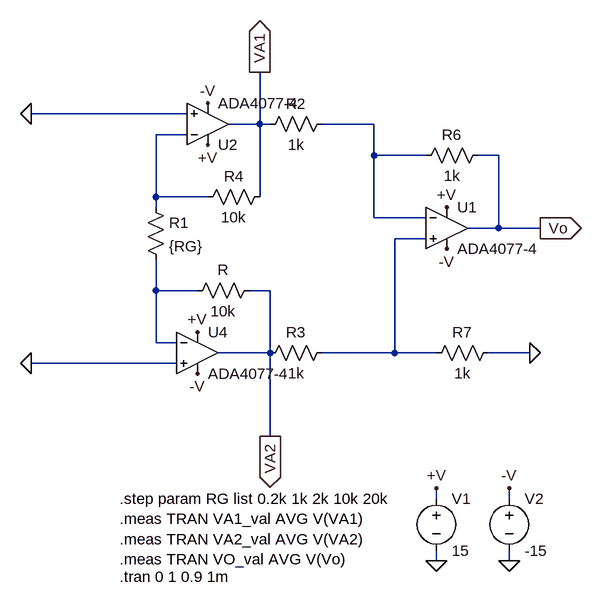
[diagram p0: schematic InstrumentationAmplifierCircuit.asc]
InstrumentationAmplifierCircuit.asc, the LTspice schematic file:
Version 4.1
SHEET 1 1140 868
WIRE 48 112 -192 112
WIRE 160 128 160 48
WIRE 160 128 112 128
WIRE 176 128 160 128
WIRE 336 128 256 128
WIRE 48 144 0 144
WIRE 336 176 336 128
WIRE 416 176 336 176
WIRE 528 176 496 176
WIRE 0 240 0 144
WIRE 80 240 0 240
WIRE 160 240 160 128
WIRE 0 256 0 240
WIRE 336 272 336 176
WIRE 416 272 336 272
WIRE 528 288 528 176
WIRE 528 288 480 288
WIRE 592 288 528 288
WIRE 416 304 368 304
WIRE 0 384 0 336
WIRE 64 384 0 384
WIRE 176 384 144 384
WIRE 0 464 0 384
WIRE 32 464 0 464
WIRE 176 480 176 384
WIRE 176 480 96 480
WIRE 368 480 368 304
WIRE 368 480 256 480
WIRE 432 480 368 480
WIRE 576 480 512 480
WIRE 32 496 -192 496
WIRE 176 608 176 480
WIRE 432 704 432 688
WIRE 544 704 544 688
WIRE 432 800 432 784
WIRE 544 800 544 784
FLAG 432 688 +V
FLAG 432 800 0
FLAG 80 160 +V
FLAG 544 688 -V
FLAG 80 96 -V
FLAG 544 800 0
FLAG 64 448 +V
FLAG 64 512 -V
FLAG 448 256 +V
FLAG 448 320 -V
FLAG 592 288 Vo
IOPIN 592 288 Out
FLAG 576 480 0
FLAG 160 48 VA1
IOPIN 160 48 Out
FLAG 176 608 VA2
IOPIN 176 608 Out
FLAG -192 112 0
FLAG -192 496 0
SYMBOL voltage 432 688 R0
WINDOW 123 0 0 Left 2
WINDOW 39 0 0 Left 2
SYMATTR InstName V1
SYMATTR Value 15
SYMBOL voltage 544 688 R0
WINDOW 123 24 146 Left 2
WINDOW 39 24 125 Left 2
SYMATTR InstName V2
SYMATTR Value -15
SYMBOL res -16 240 R0
SYMATTR InstName R1
SYMATTR Value {RG}
SYMBOL res 272 112 R90
WINDOW 0 0 56 VBottom 2
WINDOW 3 32 56 VTop 2
SYMATTR InstName R2
SYMATTR Value 1k
SYMBOL res 272 464 R90
WINDOW 0 0 56 VBottom 2
WINDOW 3 32 56 VTop 2
SYMATTR InstName R3
SYMATTR Value 1k
SYMBOL res 176 224 R90
WINDOW 0 0 56 VBottom 2
WINDOW 3 32 56 VTop 2
SYMATTR InstName R4
SYMATTR Value 10k
SYMBOL res 160 368 R90
WINDOW 0 0 56 VBottom 2
WINDOW 3 32 56 VTop 2
SYMATTR InstName R
SYMATTR Value 10k
SYMBOL res 512 160 R90
WINDOW 0 0 56 VBottom 2
WINDOW 3 32 56 VTop 2
SYMATTR InstName R6
SYMATTR Value 1k
SYMBOL res 528 464 R90
WINDOW 0 0 56 VBottom 2
WINDOW 3 32 56 VTop 2
SYMATTR InstName R7
SYMATTR Value 1k
SYMBOL OpAmps\\ADA4077-4 64 416 R0
SYMATTR InstName U4
SYMBOL OpAmps\\ADA4077-4 448 224 R0
SYMATTR InstName U1
SYMBOL OpAmps\\ADA4077-4 80 192 M180
SYMATTR InstName U2
TEXT -56 704 Left 2 !.step param RG list 0.2k 1k 2k 10k 20k\n.meas TRAN VA1_val AVG V(VA1)\n.meas TRAN VA2_val AVG V(VA2)\n.meas TRAN VO_val AVG V(Vo)
TEXT -56 824 Left 2 !.tran 0 1 0.9 1m

The netlist it stands for:
* InstrumentationAmplifierCircuit.asc
V1 +V 0 15
V2 -V 0 -15
R1 N002 N004 {RG}
R2 N001 VA1 1k
R3 N003 VA2 1k
R4 VA1 N002 10k
R VA2 N004 10k
R6 Vo N001 1k
R7 0 N003 1k
X§U4 0 N004 +V -V VA2 ADA4077-4  ; pins In+ In- V+ V- OUT
X§U1 N003 N001 +V -V Vo ADA4077-4  ; pins In+ In- V+ V- OUT
X§U2 0 N002 +V -V VA1 ADA4077-4  ; pins In+ In- V+ V- OUT
.step param RG list 0.2k 1k 2k 10k 20k
.meas TRAN VA1_val AVG V(VA1)
.meas TRAN VA2_val AVG V(VA2)
.meas TRAN VO_val AVG V(Vo)
.tran 0 1 0.9 1m
.backanno
.end